# Altium schematic sheet SensorsTeam5.SchDoc
size C
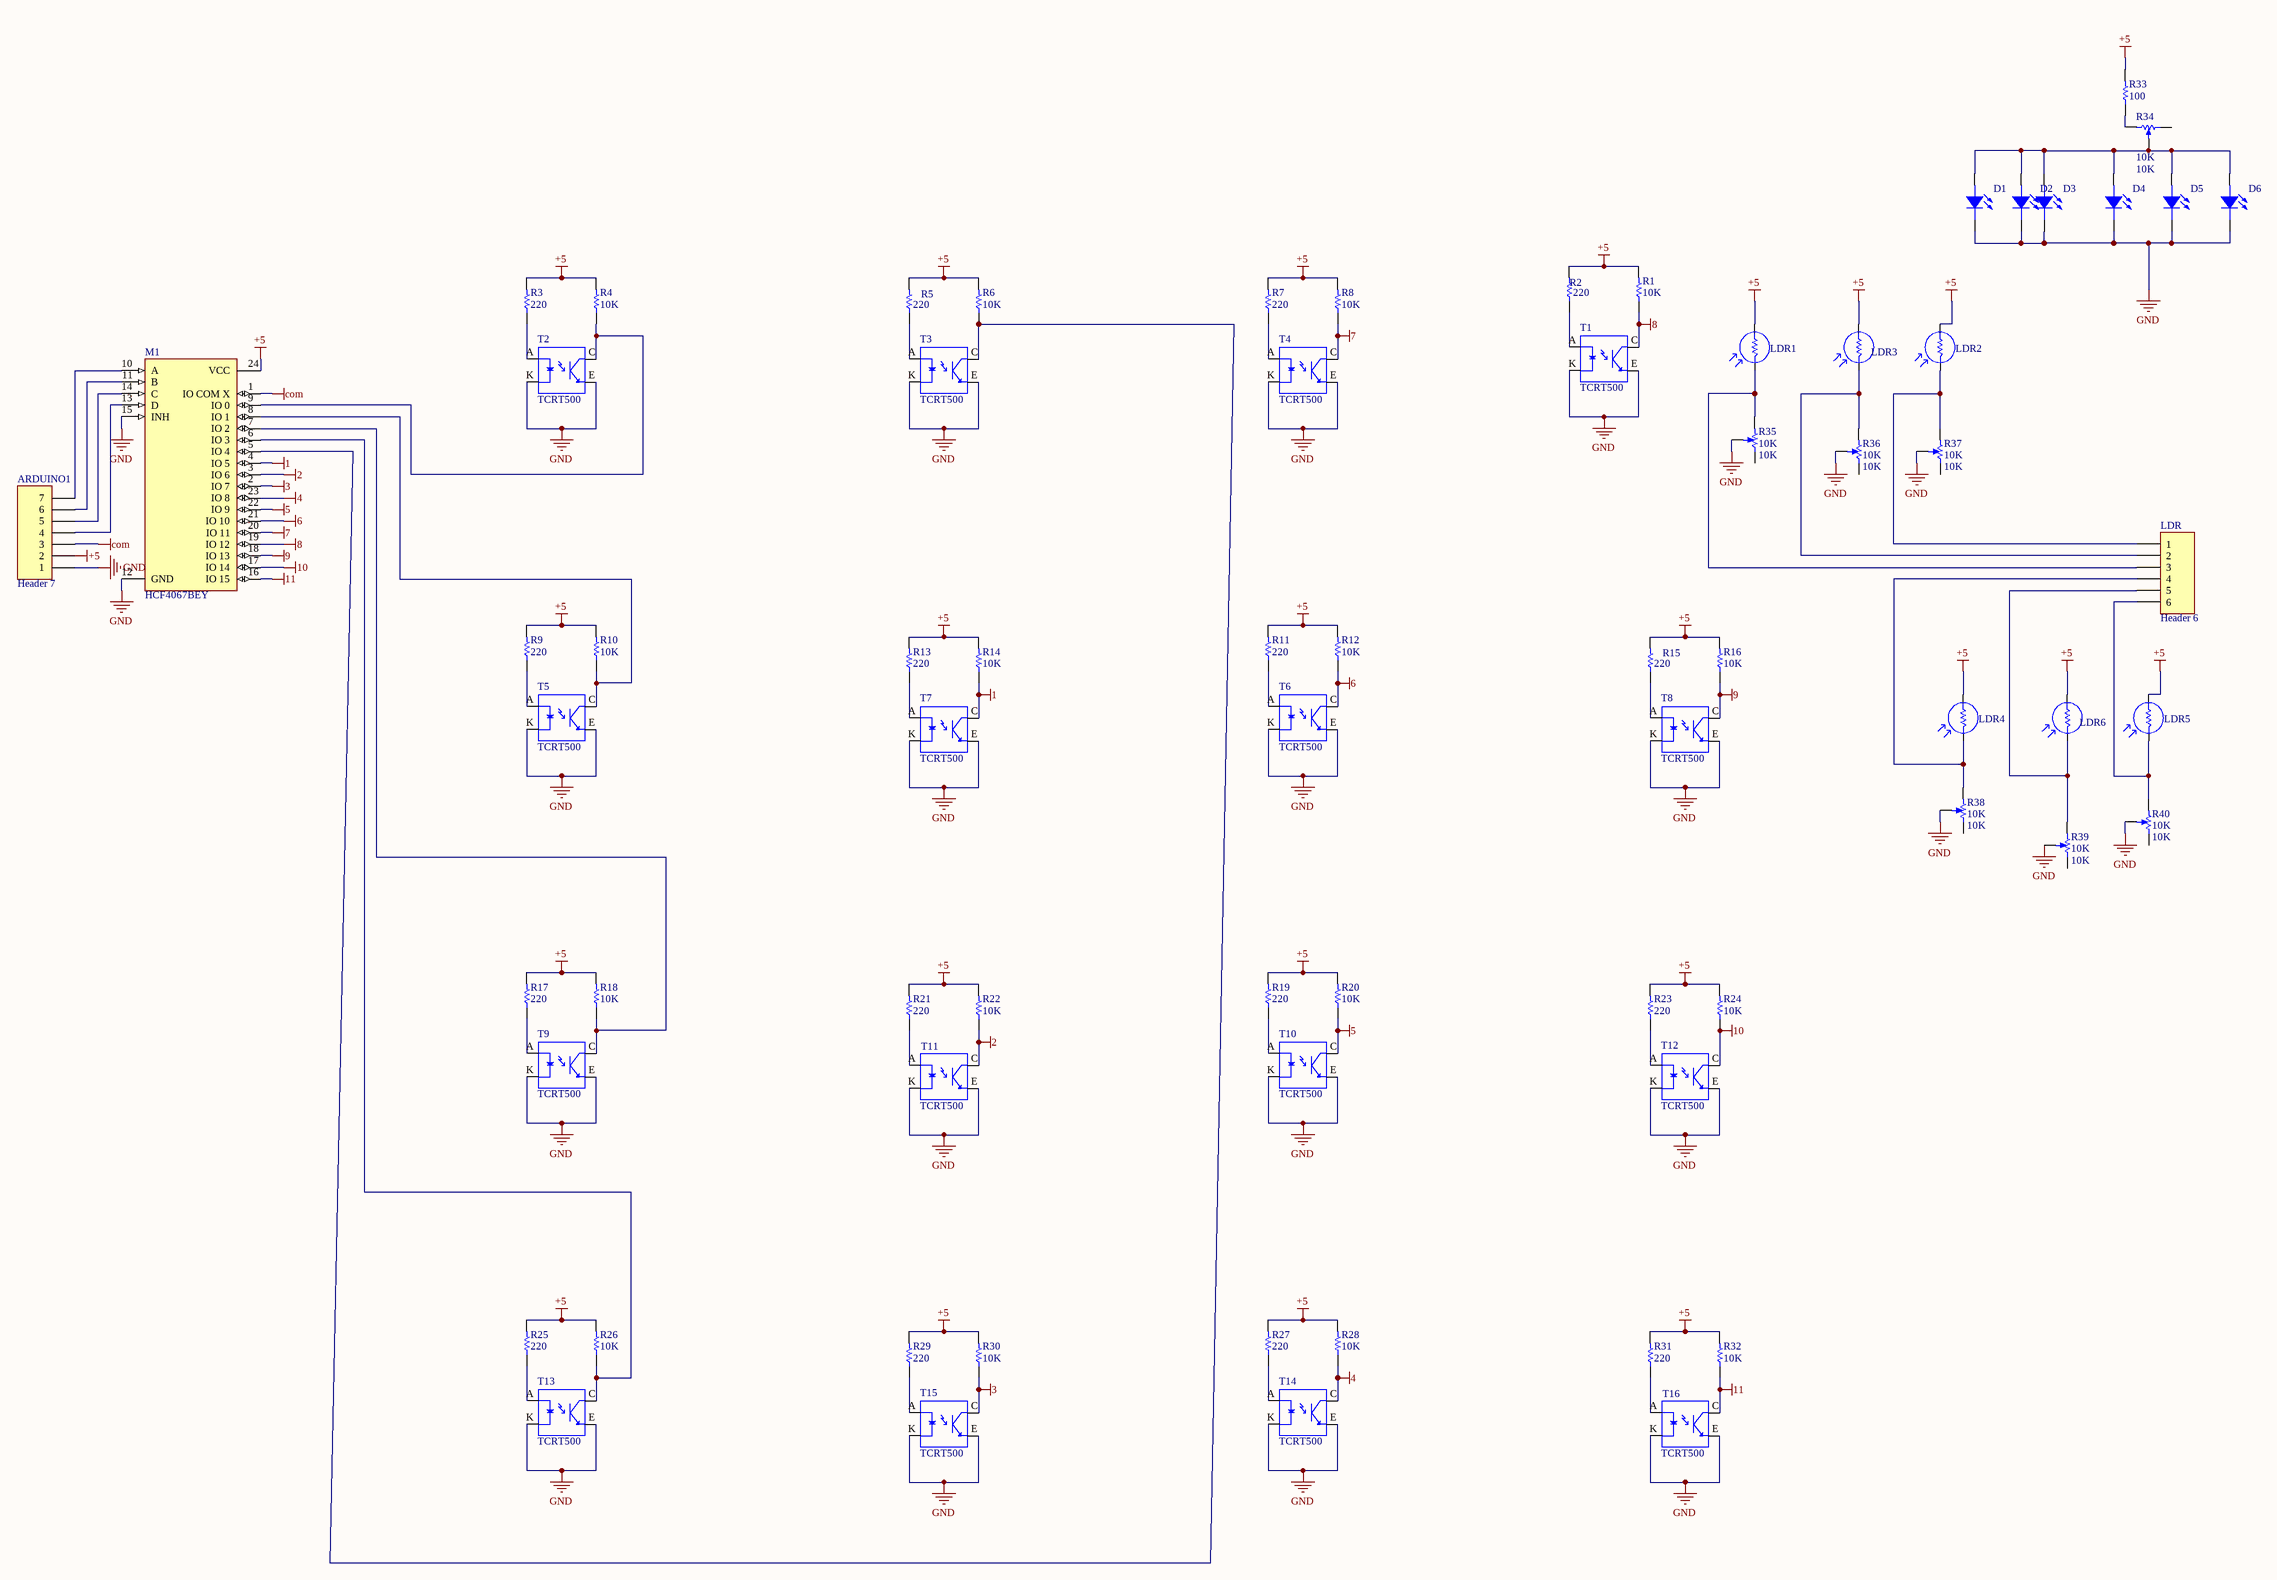
[diagram p0: SensorsTeam5.SchDoc]

## Parts
ARDUINO1  Header 7  [HDR1X7]
D1  LED3MM  [LED3mm_GRN]  (value not drawn)
D2  LED3MM  [LED3mm_GRN]  (value not drawn)
D3  LED3MM  [LED3mm_GRN]  (value not drawn)
D4  LED3MM  [LED3mm_GRN]  (value not drawn)
D5  LED3MM  [LED3mm_GRN]  (value not drawn)
D6  LED3MM  [LED3mm_GRN]  (value not drawn)
LDR  Header 6  [HDR1X6]
LDR1  PhotoCell  [PhotoCell]  (value not drawn)
LDR2  PhotoCell  [PhotoCell]  (value not drawn)
LDR3  PhotoCell  [PhotoCell]  (value not drawn)
LDR4  PhotoCell  [PhotoCell]  (value not drawn)
LDR5  PhotoCell  [PhotoCell]  (value not drawn)
LDR6  PhotoCell  [PhotoCell]  (value not drawn)
M1  HCF4067BEY  [PDIP24]
R1  10K  [RES-(1/4)]
R2  220  [RES-(1/4)]
R3  220  [RES-(1/4)]
R4  10K  [RES-(1/4)]
R5  220  [RES-(1/4)]
R6  10K  [RES-(1/4)]
R7  220  [RES-(1/4)]
R8  10K  [RES-(1/4)]
R9  220  [RES-(1/4)]
R10  10K  [RES-(1/4)]
R11  220  [RES-(1/4)]
R12  10K  [RES-(1/4)]
R13  220  [RES-(1/4)]
R14  10K  [RES-(1/4)]
R15  220  [RES-(1/4)]
R16  10K  [RES-(1/4)]
R17  220  [RES-(1/4)]
R18  10K  [RES-(1/4)]
R19  220  [RES-(1/4)]
R20  10K  [RES-(1/4)]
R21  220  [RES-(1/4)]
R22  10K  [RES-(1/4)]
R23  220  [RES-(1/4)]
R24  10K  [RES-(1/4)]
R25  220  [RES-(1/4)]
R26  10K  [RES-(1/4)]
R27  220  [RES-(1/4)]
R28  10K  [RES-(1/4)]
R29  220  [RES-(1/4)]
R30  10K  [RES-(1/4)]
R31  220  [RES-(1/4)]
R32  10K  [RES-(1/4)]
R33  100  [RESC3413X04N]
R34  10K  [POT4MM-Small Pot]
R35  10K  [POT4MM-Small Pot]
R36  10K  [POT4MM-Small Pot]
R37  10K  [POT4MM-Small Pot]
R38  10K  [POT4MM-Small Pot]
R39  10K  [POT4MM-Small Pot]
R40  10K  [POT4MM-Small Pot]
T1  TCRT500  [TCRT5000]
T2  TCRT500  [TCRT5000]
T3  TCRT500  [TCRT5000]
T4  TCRT500  [TCRT5000]
T5  TCRT500  [TCRT5000]
T6  TCRT500  [TCRT5000]
T7  TCRT500  [TCRT5000]
T8  TCRT500  [TCRT5000]
T9  TCRT500  [TCRT5000]
T10  TCRT500  [TCRT5000]
T11  TCRT500  [TCRT5000]
T12  TCRT500  [TCRT5000]
T13  TCRT500  [TCRT5000]
T14  TCRT500  [TCRT5000]
T15  TCRT500  [TCRT5000]
T16  TCRT500  [TCRT5000]

## Nets
1: M1.4(IO_5) R14.1 T7.C
2: M1.3(IO_6) R22.1 T11.C
3: M1.2(IO_7) R30.1 T15.C
4: M1.23(IO_8) R28.1 T14.C
5: M1.22(IO_9) R20.1 T10.C
6: M1.21(IO_10) R12.1 T6.C
7: M1.20(IO_11) R8.1 T4.C
8: M1.19(IO_12) R1.1 T1.C
9: M1.18(IO_13) R16.1 T8.C
10: M1.17(IO_14) R24.1 T12.C
11: M1.16(IO_15) R32.1 T16.C
+5: ARDUINO1.2 LDR1.2 LDR2.2 LDR3.2 LDR4.2 LDR5.2 LDR6.2 M1.24(VCC) R1.2 R2.2 R3.2 R4.2 R5.2 R6.2 R7.2 R8.2 R9.2 R10.2 R11.2 R12.2 R13.2 R14.2 R15.2 R16.2 R17.2 R18.2 R19.2 R20.2 R21.2 R22.2 R23.2 R24.2 R25.2 R26.2 R27.2 R28.2 R29.2 R30.2 R31.2 R32.2 R33.2
com: ARDUINO1.3 M1.1(IO_COM_X)
GND: ARDUINO1.1 D1.2(CATHODE) D2.2(CATHODE) D3.2(CATHODE) D4.2(CATHODE) D5.2(CATHODE) D6.2(CATHODE) M1.12(GND) M1.15(INH) R35.W R36.W R37.W R38.W R39.W R40.W T1.E T1.K T2.E T2.K T3.E T3.K T4.E T4.K T5.E T5.K T6.E T6.K T7.E T7.K T8.E T8.K T9.E T9.K T10.E T10.K T11.E T11.K T12.E T12.K T13.E T13.K T14.E T14.K T15.E T15.K T16.E T16.K
NetARDUINO1_4: ARDUINO1.4 M1.13(D)
NetARDUINO1_5: ARDUINO1.5 M1.14(C)
NetARDUINO1_6: ARDUINO1.6 M1.11(B)
NetARDUINO1_7: ARDUINO1.7 M1.10(A)
NetD1_1: D1.1(ANODE) D2.1(ANODE) D3.1(ANODE) D4.1(ANODE) D5.1(ANODE) D6.1(ANODE) R34.W
NetLDR_1: LDR.1 LDR2.1 R37.CCW(-)
NetLDR_2: LDR.2 LDR3.1 R36.CCW(-)
NetLDR_3: LDR.3 LDR1.1 R35.CCW(-)
NetLDR_4: LDR.4 LDR4.1 R38.CCW(-)
NetLDR_5: LDR.5 LDR6.1 R39.CCW(-)
NetLDR_6: LDR.6 LDR5.1 R40.CCW(-)
NetM1_5: M1.5(IO_4) R6.1 T3.C
NetM1_6: M1.6(IO_3) R26.1 T13.C
NetM1_7: M1.7(IO_2) R18.1 T9.C
NetM1_8: M1.8(IO_1) R10.1 T5.C
NetM1_9: M1.9(IO_0) R4.1 T2.C
NetR2_1: R2.1 T1.A
NetR3_1: R3.1 T2.A
NetR5_1: R5.1 T3.A
NetR7_1: R7.1 T4.A
NetR9_1: R9.1 T5.A
NetR11_1: R11.1 T6.A
NetR13_1: R13.1 T7.A
NetR15_1: R15.1 T8.A
NetR17_1: R17.1 T9.A
NetR19_1: R19.1 T10.A
NetR21_1: R21.1 T11.A
NetR23_1: R23.1 T12.A
NetR25_1: R25.1 T13.A
NetR27_1: R27.1 T14.A
NetR29_1: R29.1 T15.A
NetR31_1: R31.1 T16.A
NetR33_1: R33.1 R34.CCW(-)

Not connected (* = marked no-connect by the designer): R34 CW(+); R35 CW(+); R36 CW(+); R37 CW(+); R38 CW(+); R39 CW(+); R40 CW(+)

## Library data of the parts
ARDUINO1 = Header 7: Header, 7-Pin; LatestRevisionDate: 17-Jul-2002; LatestRevisionNote: Re-released for DXP Platform.; Publisher: Altium Limited
D1-D6 = LED 3MM: Light Emitting Diode; Designer: Ali Hafizi
LDR = Header 6: Header, 6-Pin; LatestRevisionDate: 17-Jul-2002; LatestRevisionNote: Re-released for DXP Platform.; Publisher: Altium Limited
LDR1-LDR6 = LDR: Photo Cell- Variable Resistor With Light; Company: IPA CO.; Designer: Saeid Jorablo; Last Update Time: 2008/07/17
M1 = HCF4067BEY: Analog Multiplexer/Demultiplexer; Published: 8-Jun-2000; LatestRevisionDate: 06-Jun-2005; LatestRevisionNote: Stylized 3D Model Added.; DatasheetVersion: Sep-1988; PackageVersion: Jan-1995; PackageReference: PDIP24; Publisher: Altium Limited; PackageDescription: DIP; 24 Leads; Row Spacing 15.24 mm; Pitch 2.54 mm; ComponentLink1Description: Manufacturer Link; ComponentLink1URL: http://www.st.com/
R1-R33 = RES 0805 0.125W: RES 0805; Designer: Abbas Basereh; Desc.: RES SMD 0805; Data: 16-12-2016
R34-R40 = POT SMD: Square Trimming Potentiometer; Published: 17-Dec-2003; DatasheetVersion: Oct-2003; PackageReference: POT4MM-2; Publisher: Altium Limited; PackageDescription: Square Trimming Potentiometer; ComponentLink1Description: Manufacturer Link; ComponentLink1URL: http://bourns.com/2/search.html; Value: 10K
T1-T16 = TCRT5000